# Altium schematic sheet 智慧景区导航.SchDoc
size A4
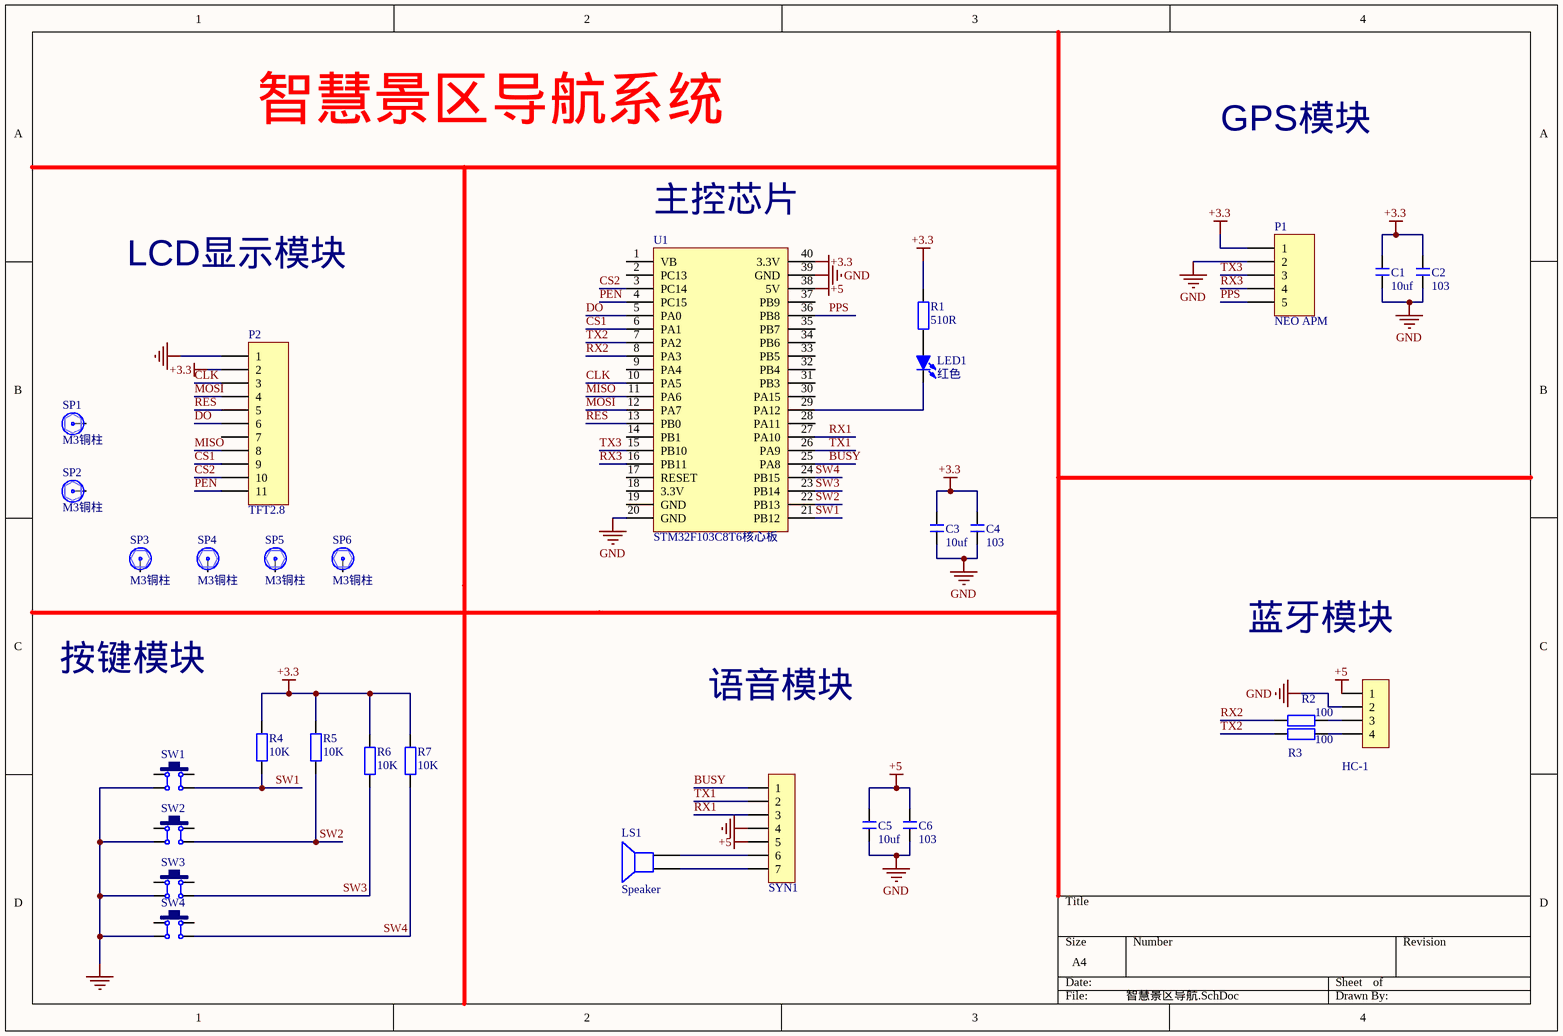
[diagram p0: 智慧景区导航.SchDoc]

## Parts
C1  10uf  [R 0805_M]
C2  103  [R 0805_M]
C3  10uf  [R 0805_M]
C4  103  [R 0805_M]
C5  10uf  [R 0805_M]
C6  103  [R 0805_M]
HC-1  HDR-1X4  [HDR2.54-M-LI-4P]  (value not drawn)
LED1  红色  [LED 0805R]
LS1  Speaker  [PIN2]
P1  NEO APM  [HDR1X5]
P2  TFT2.8  [HDR1X11]
R1  510R  [R 0805_M]
R2  100  [R 0805_M]
R3  100  [R 0805_M]
R4  10K  [R 0805_M]
R5  10K  [R 0805_M]
R6  10K  [R 0805_M]
R7  10K  [R 0805_M]
SP1  M3铜柱  [M3x4_L]
SP2  M3铜柱  [M3x4_L]
SP3  M3铜柱  [M3x4_L]
SP4  M3铜柱  [M3x4_L]
SP5  M3铜柱  [M3x4_L]
SP6  M3铜柱  [M3x4_L]
SW1  6x6x5  [TSW DIP-6*6*6]  (value not drawn)
SW2  6x6x5  [TSW DIP-6*6*6]  (value not drawn)
SW3  6x6x5  [TSW DIP-6*6*6]  (value not drawn)
SW4  6x6x5  [TSW DIP-6*6*6]  (value not drawn)
SYN1  HDR-1X7  [PH2.0-LI-7P]  (value not drawn)
U1  STM32F103C8T6核心板  [DIP40-600_MH]

## Nets
+3.3: C1.1 C2.1 C3.1 C4.1 P1.1 P2.2 R1.2 R4.2 R5.2 R6.2 R7.2 U1.40(3.3V)
+5: C5.1 C6.1 HC-1.1 SYN1.5 U1.38(5V)
GND: C1.2 C2.2 C3.2 C4.2 C5.2 C6.2 HC-1.2 P1.2 P2.1 SW1.2 SW2.2 SW3.2 SW4.2 SYN1.4 U1.20(GND) U1.39(GND)
BUSY: SYN1.1 U1.25(PA8)
CLK: P2.3 U1.10(PA5)
CS1: P2.9 U1.6(PA1)
CS2: P2.10 U1.3(PC14)
DO: P2.6 U1.5(PA0)
MISO: P2.8 U1.11(PA6)
MOSI: P2.4 U1.12(PA7)
PEN: P2.11 U1.4(PC15)
PPS: P1.5 U1.36(PB8)
RES: P2.5 U1.13(PB0)
RX1: SYN1.3 U1.27(PA10)
RX2: R2.2 U1.8(PA3)
RX3: P1.4 U1.16(PB11)
SW1: R4.1 SW1.4 U1.21(PB12)
SW2: R5.1 SW2.4 U1.22(PB13)
SW3: R6.1 SW3.4 U1.23(PB14)
SW4: R7.1 SW4.4 U1.24(PB15)
TX1: SYN1.2 U1.26(PA9)
TX2: R3.2 U1.7(PA2)
TX3: P1.3 U1.15(PB10)
NetHC-1_3: HC-1.3 R2.1
NetHC-1_4: HC-1.4 R3.1
NetLED1_1: LED1.1(A) R1.1
NetLED1_2: LED1.2(K) U1.29(PA12)
NetLS1_1: LS1.1 SYN1.7
NetLS1_2: LS1.2 SYN1.6

Not connected (* = marked no-connect by the designer): P2 7; SP1 1; SP2 1; SP3 1; SP4 1; SP5 1; SP6 1; SW1 1 3(2); SW2 1 3(2); SW3 1 3(2); SW4 1 3(2); U1 1(VB) 2(PC13) 9(PA4) 14(PB1) 17(RESET) 18(3.3V) 19(GND) 28(PA11) 30(PA15) 31(PB3) 32(PB4) 33(PB5) 34(PB6) 35(PB7) 37(PB9)

## Notes on the sheet
- 智慧景区导航系统
- GPS模块
- (near U1) 主控芯片
- LCD显示模块
- 蓝牙模块
- 按键模块
- 语音模块

## Library data of the parts
C1-C6 = C-CC: 直插瓷片电容; 版权归属: 源创客; BOM名称: 直插瓷片电容; 学习资源: www.ooocke.com
HC-1 = Header 4: 4P接插件; 版权归属: 源创客; BOM名称: 4P接插件; 学习资源: www.ooocke.com
LED1 = LED-SMD: 贴片LED; 版权归属: 源创客; BOM名称: 贴片LED; 学习资源: www.ooocke.com
LS1 = Speaker: Loudspeaker; Published: 24-Mar-1999; LatestRevisionDate: 17-Jul-2002; LatestRevisionNote: Re-released for DXP Platform.; PackageReference: PIN2; Publisher: Altium Limited
P1 = Header 5: Header, 5-Pin; LatestRevisionDate: 17-Jul-2002; LatestRevisionNote: Re-released for DXP Platform.; Publisher: Altium Limited
P2 = Header 11: Header, 11-Pin; LatestRevisionDate: 17-Jul-2002; LatestRevisionNote: Re-released for DXP Platform.; Publisher: Altium Limited
R1-R7 = R-CRR: 直插色环电阻; BOM名称: 色环电阻; 版权归属: 源创客; 学习资源: www.ooocke.com
SP1-SP6 = 铜柱小焊盘: 铜柱; 版权归属: 源创客; BOM名称: 铜柱; 学习资源: www.ooocke.com
SW1-SW4 = TSW DIP-6x6: 直插6x6轻触开关; 试用产品: 如您满意请支持正品; BOM名称: 直插6x6轻触开关; 学习资源: www.ooocke.com
SYN1 = Header 7: 7P接插件; 版权归属: 源创客; BOM名称: 7P接插件; 学习资源: www.ooocke.com